# Altium schematic sheet SAMV71_Xplained_Ultra_Ethernet.SchDoc: Ethernet
size A3; Organization: ATMEL Norway; Address1: Vestre Rosten 79; Address2: N-7075 TILLER; Address3: NORWAY; DocumentNumber: A09-2407; Revision: 11; SheetNumber: 10; SheetTotal: 13; DrawnBy: Microchip Norway; Engineer: AH; PageSetup: Record=PageOptions|CenterHorizontal=True|CenterVertical=True|PrintScale=1.04|XCorrection=1.00|YCorrection=1.00|PrintKind=1|BorderSize=5000000|LeftOffset=0|BottomOffset=0|Orientation=2|PaperLength=1000|PaperWidth=1000|Scale=100|PaperSource=7|PrintQuality=-4|MediaType=1|DitherType=10|PrintScaleMode=1|PaperKind=A3 (297 x 420 mm)|PaperIndex=8; ProjectTitle: SAM V71 Xplained Ultra; PCBNumber: A08-2216; PCBRevision: 4
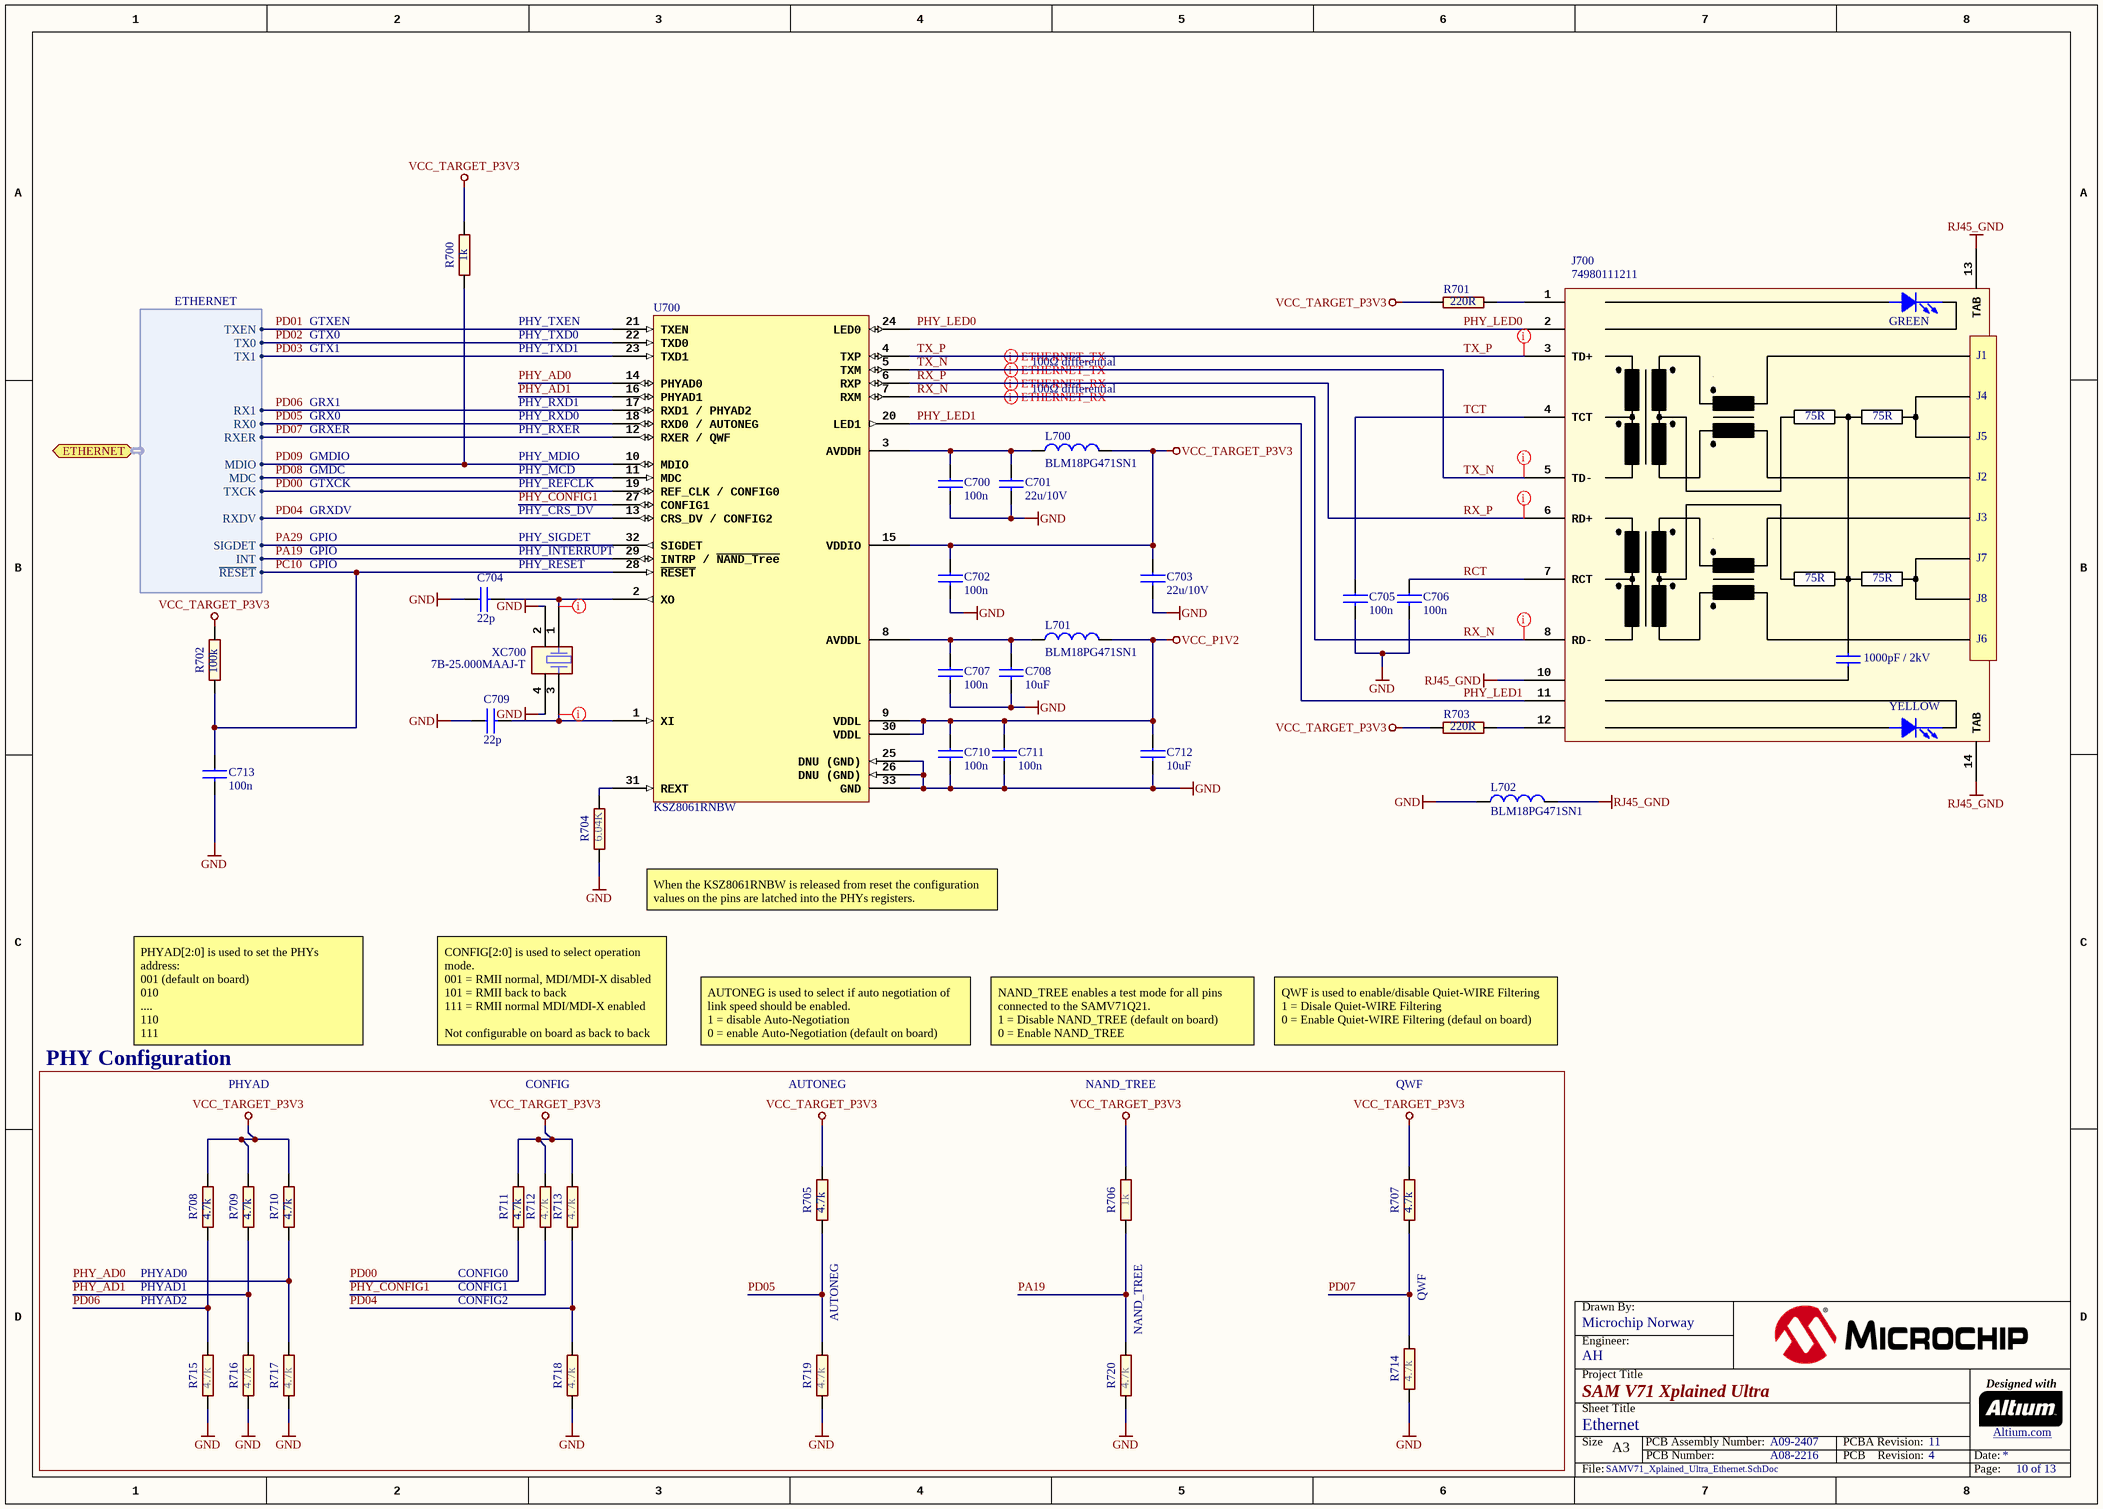
[diagram p0: SAMV71_Xplained_Ultra_Ethernet.SchDoc]

## Parts
C700  value 100n  [AP1-00001]
C701  value 22u/10V  [AP1-00003]
C702  value 100n  [AP1-00001]
C703  value 22u/10V  [AP1-00003]
C704  value 22p  [AP1-00001]
C705  value 100n  [AP1-00001]
C706  value 100n  [AP1-00001]
C707  value 100n  [AP1-00001]
C708  value 10uF  [AP1-00041]
C709  value 22p  [AP1-00001]
C710  value 100n  [AP1-00001]
C711  value 100n  [AP1-00001]
C712  value 10uF  [AP1-00041]
C713  value 100n  [AP1-00001]
J700  value 74980111211  [AP8-00749]
L700  value BLM18PG471SN1  [AP3-00005]
L701  value BLM18PG471SN1  [AP3-00005]
L702  value BLM18PG471SN1  [AP3-00005]
R700  value 1k  [AP2-00000]
R701  value 220R  [AP2-00000]
R702  value 100k  [AP2-00000]
R703  value 220R  [AP2-00000]
R704  value 6.04K  [AP2-00000]
R705  value 4.7k  [AP2-00000]
R706  value 1k  [AP2-00000]
R707  value 4.7k  [AP2-00000]
R708  value 4.7k  [AP2-00000]
R709  value 4.7k  [AP2-00000]
R710  value 4.7k  [AP2-00000]
R711  value 4.7k  [AP2-00000]
R712  value 4.7k  [AP2-00000]
R713  value 4.7k  [AP2-00000]
R714  value 4.7k  [AP2-00000]
R715  value 4.7k  [AP2-00000]
R716  value 4.7k  [AP2-00000]
R717  value 4.7k  [AP2-00000]
R718  value 4.7k  [AP2-00000]
R719  value 4.7k  [AP2-00000]
R720  value 4.7k  [AP2-00000]
U700  value KSZ8061RNBW  [AP6-00349]  (hidden comment: Industrial Extended Temperature)
XC700  value 7B-25.000MAAJ-T  [AP7-00067]

## Blocks framed on the sheet
PHY Configuration: R705-R720

## Ports
ETHERNET (harness ETHERNET)

## Harnesses
ETHERNET: TX0, TX1, TXEN, TXCK, RX0, RX1, MDC, MDIO, RXER, RXDV, INT, ~{RESET}, SIGDET

## Nets
GND: C700.2 C701.2 C702.2 C703.2 C704.1 C705.2 C706.2 C707.2 C708.2 C709.1 C710.2 C711.2 C712.2 C713.2 L702.1 R704.1 R714.2 R715.2 R716.2 R717.2 R718.1 R719.2 R720.2 U700.25(DNU_(GND)) U700.26(DNU_(GND)) U700.33(GND) XC700.2 XC700.4
RJ45_GND: J700.10 J700.13(TAB) J700.14(TAB) L702.2
VCC_P1V2: C710.1 C711.1 C712.1 L701.1 U700.9(VDDL) U700.30(VDDL)
VCC_TARGET_P3V3: C702.1 C703.1 L700.1 R700.2 R701.2 R702.2 R703.1 R705.2 R706.2 R707.2 R708.2 R709.2 R710.2 R711.2 R712.2 R713.2 U700.15(VDDIO)
PA19: R706.1 R720.1 U700.29(INTRP_/_~{NAND_Tree}) ; port ETHERNET.INT
PA29: U700.32(SIGDET) ; port ETHERNET.SIGDET
PC10: C713.1 R702.1 U700.28(~{RESET}) ; port ETHERNET.~{RESET}
PD00: R711.1 U700.19(REF_CLK_/_CONFIG0) ; port ETHERNET.TXCK
PD01: U700.21(TXEN) ; port ETHERNET.TXEN
PD02: U700.22(TXD0) ; port ETHERNET.TX0
PD03: U700.23(TXD1) ; port ETHERNET.TX1
PD04: R713.1 R718.2 U700.13(CRS_DV_/_CONFIG2) ; port ETHERNET.RXDV
PD05: R705.1 R719.1 U700.18(RXD0_/_AUTONEG) ; port ETHERNET.RX0
PD06: R708.1 R715.1 U700.17(RXD1_/_PHYAD2) ; port ETHERNET.RX1
PD07: R707.1 R714.1 U700.12(RXER_/_QWF) ; port ETHERNET.RXER
PD08: U700.11(MDC) ; port ETHERNET.MDC
PD09: R700.1 U700.10(MDIO) ; port ETHERNET.MDIO
PHY_AD0: R710.1 R717.1 U700.14(PHYAD0)
PHY_AD1: R709.1 R716.1 U700.16(PHYAD1)
PHY_CONFIG1: R712.1 U700.27(CONFIG1)
PHY_LED0: J700.2 U700.24(LED0)
PHY_LED1: J700.11 U700.20(LED1)
RCT: C706.1 J700.7(RCT)
RX_N: J700.8(RD-) U700.7(RXM)
RX_P: J700.6(RD+) U700.6(RXP)
TCT: C705.1 J700.4(TCT)
TX_N: J700.5(TD-) U700.5(TXM)
TX_P: J700.3(TD+) U700.4(TXP)
NetC700_1: C700.1 C701.1 L700.2 U700.3(AVDDH)
NetC704_2: C704.2 U700.2(XO) XC700.1
NetC707_1: C707.1 C708.1 L701.2 U700.8(AVDDL)
NetC709_2: C709.2 U700.1(XI) XC700.3
NetJ700_1: J700.1 R701.1
NetJ700_12: J700.12 R703.2
NetR704_2: R704.2 U700.31(REXT)

## Layout directives
differential pair: RX_N, RX_P, TX_N, TX_P
rule Assembly Testpoint Usage [Testpoint - Not Allowed    Multiple - Not Allowed]; rule Fabrication Testpoint Usage [Testpoint - Not Allowed    Multiple - Not Allowed]: NetC704_2, NetC709_2, RX_N, RX_P, TX_N, TX_P

## Notes on the sheet
- GTXEN
- GTX0
- GTX1
- PHY_TXEN
- PHY_TXD0
- PHY_TXD1
- 100Ω differential
- GRX1
- GRX0
- GRXER
- PHY_RXD1
- PHY_RXD0
- PHY_RXER
- GMDIO
- GMDC
- GTXCK
- GRXDV
- PHY_MDIO
- PHY_MCD
- PHY_REFCLK
- PHY_CRS_DV
- GPIO
- PHY_SIGDET
- PHY_INTERRUPT
- (near C704) PHY_RESET
- When the KSZ8061RNBW is released from reset the configuration values on the pins are latched into the PHYs registers.
- PHYAD[2:0] is used to set the PHYs address:
  001 (default on board)
  010
  ....
  110
  111
- CONFIG[2:0] is used to select operation mode.
  001 = RMII normal, MDI/MDI-X disabled
  101 = RMII back to back
  111 = RMII normal MDI/MDI-X enabled
  Not configurable on board as back to back mode is not applicable for this design.
- AUTONEG is used to select if auto negotiation of link speed should be enabled.
  1 = disable Auto-Negotiation
  0 = enable Auto-Negotiation (default on board)
- NAND_TREE enables a test mode for all pins connected to the SAMV71Q21.
  1 = Disable NAND_TREE (default on board)
  0 = Enable NAND_TREE
- QWF is used to enable/disable Quiet-WIRE Filtering
  1 = Disale Quiet-WIRE Filtering
  0 = Enable Quiet-WIRE Filtering (defaul on board)
- PHYAD
- CONFIG
- AUTONEG
- NAND_TREE
- QWF
- PHYAD0
- PHYAD1
- PHYAD2
- CONFIG0
- CONFIG1
- CONFIG2
- (near R719) AUTONEG
- (near R720) NAND_TREE
- Drawn By:
- Project Title
- Engineer:
- Designed with
- Sheet Title
- Size
- A3
- PCB Number:
- PCB Assembly Number:
- PCBA Revision:
- PCB    Revision:
- Date:
- Altium.com <http://go.altium.com/MicrochipLandingPage_Evaluation.html>
- File:
- Page:
- (in symbol A08-1816) GREEN; J1; J4; 75R; J5; J2; J3; J7; J8; J6; 1000pF / 2kV; YELLOW

## Library data of the parts
C700 C702 C705-C707 C710 C711 C713 = A01-0246: Ceramic capacitor, SMD 0402, X7R, 16V, +/-10%; PartGroup: Capacitors,Ceramic,SMD 0402; Manufacturer: Kemet; MPN: C0402C104K4RACTU; TemperatureRange: -55 - +125 deg C; Status: Active; AN: A01-0246; Tolerance: 16V, +/-10%; Height: 0,5
C701 C703 = A01-0500: Ceramic capacitor, SMD 0805, X5R, 10V, ±20%; PartGroup: Capacitors,Ceramic,SMD 0805; Manufacturer: tdk; MPN: C2012X5R1A226M/0.85; TemperatureRange: -55Â°C to +85Â°C; Status: Active; AN: A01-0500; Height: 0,949999988079071
C704 C709 = A01-0019: Ceramic capacitor, SMD 0402, NP0, 50V, +/-5%; PartGroup: Capacitors,Ceramic,SMD 0402; Manufacturer: YAGEO CORP; MPN: CC0402JRNPO9BN220; TemperatureRange: -55 - +125 deg C; Status: Active; AN: A01-0019; Tolerance: 50V, +/-5%; Height: 0,550000011920929
C708 C712 = A01-0360: Ceramic capacitor, SMD 0805, X7R, 10V, 10 %, (de19441); PartGroup: Capacitors,Ceramic,SMD 0805; Manufacturer: Murata; MPN: GRM21BR61A106KE19L; Tolerance: 10%; TemperatureRange: -55 - +85 deg C; Status: Active; AN: A01-0360; Height: 1,25
J700 = A08-1816: 10/100Base-TX, SMD, RJ45, green and yellow LEDs, integrated magnetics; PartGroup: Mechanical devices,Connectors,Other; Manufacturer: Wurth Elektronik; TemperatureRange: -40°C to +85°C; AN: A08-1816; Height: 13,6099996566772; MPN: 74980111211
L700-L702 = A03-0035: SMD RF inductor 0603. Z=470Ohm (@100MHz), Max R(dc)=0.65Ohm, Max current=1A; PartGroup: Inductors,EMI; Manufacturer: Murata; TemperatureRange: -55; Status: Active; AN: A03-0035; Height: 0,800000011920929; MPN: BLM18PG471SN1
R700 R706 = A02-0212: Thick film resistor, SMD 0402, 1/16W, 1%; PartGroup: Resistors,SMD,0402 1%; Manufacturer: ASJ; MPN: CR10-1001-FK; TemperatureRange: -55 - +125 deg C; Status: Active; AN: A02-0212; Tolerance: 1 %; Height: 0,349999994039536
R701 R703 = A02-0196: Thick film resistor, SMD 0402, 1/16W, 1%; PartGroup: Resistors,SMD,0402 1%; Manufacturer: ASJ; MPN: CR10-2200-FK; TemperatureRange: -55 - +125 deg C; Status: Active; AN: A02-0196; Tolerance: 1 %; Height: 0,349999994039536
R702 = A02-0260: Thick film resistor, SMD 0402, 1/16W, 1%; PartGroup: Resistors,SMD,0402 1%; Manufacturer: ASJ; MPN: CR10-1003-FK; TemperatureRange: -55ï¿½ to +125ï¿½C; Status: Active; AN: A02-0260; Tolerance: 1 %; Height: 0,349999994039536
R704 = A02-0914: Thick film resistor, SMD 0402, 1/16W, 1%, E192; PartGroup: Resistors,SMD,0402 1%; TemperatureRange: -55 to +125 deg C; Status: Active; AN: A02-0914; Tolerance: 1%; Height: 0,349999994039536
R705 R707-R720 = A02-0228: Thick film resistor, SMD 0402, 1/16W, 1%; PartGroup: Resistors,SMD,0402 1%; Manufacturer: PHYCOMP; MPN: 2322 706 74702L; TemperatureRange: -55ï¿½ to +125ï¿½C; Status: Active; AN: A02-0228; Tolerance: 1 %; Height: 0,349999994039536
U700 = A06-1490: 10Base-T/100Base-TX PHY, RMII, EEE, 50MHz clock output; PartGroup: Integrated Circuits,Interface ICs,Ethernet; Manufacturer: Microchip; TemperatureRange: -40Â°C to +105Â°C; AN: A06-1490; Height: 0,850000023841858; MPN: KSZ8061RNBW
XC700 = A07-0088: 25.000 MHz crystal, 18pF, ±30ppm, 5.0 x 3.2 mm; PartGroup: Frequency devices,Crystals,SMD; Manufacturer: TXC Corporation; Tolerance: Â±30ppm; TemperatureRange: -40Â°C to +85Â°C; Status: Active; AN: A07-0088; Height: 1,04999995231628; MPN: 7B-25.000MAAJ-T